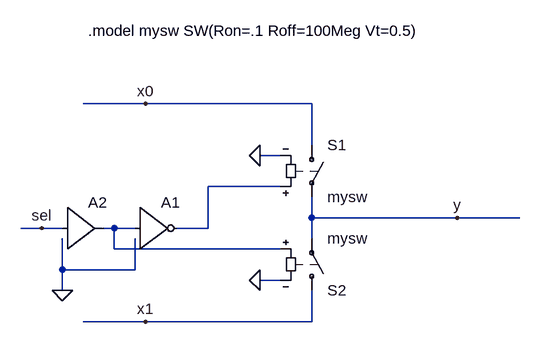
[diagram p0: schematic ideal_amux.asc]
ideal_amux.asc, the LTspice schematic file:
Version 4
SHEET 1 2652 680
WIRE 640 -48 544 -48
WIRE 896 -48 640 -48
WIRE 896 16 896 -48
WIRE 848 32 816 32
WIRE 848 80 736 80
WIRE 896 128 896 96
WIRE 1120 128 896 128
WIRE 1216 128 1120 128
WIRE 480 144 448 144
WIRE 512 144 480 144
WIRE 592 144 576 144
WIRE 624 144 592 144
WIRE 736 144 736 80
WIRE 736 144 688 144
WIRE 896 160 896 128
WIRE 592 176 592 144
WIRE 848 176 592 176
WIRE 512 208 512 160
WIRE 624 208 624 160
WIRE 624 208 512 208
WIRE 848 224 816 224
WIRE 512 240 512 208
WIRE 640 288 544 288
WIRE 896 288 896 240
WIRE 896 288 640 288
FLAG 640 -48 x0
FLAG 640 288 x1
FLAG 1120 128 y
FLAG 480 144 sel
FLAG 816 224 0
FLAG 816 32 0
FLAG 512 240 0
SYMBOL sw 896 0 R0
SYMATTR InstName S1
SYMATTR Value mysw
SYMBOL sw 896 256 M180
SYMATTR InstName S2
SYMATTR Value mysw
SYMBOL Digital\\inv 624 80 R0
SYMATTR InstName A1
SYMBOL Digital\\buf1 512 80 R0
SYMATTR InstName A2
TEXT 552 -160 Left 2 !.model mysw SW(Ron=.1 Roff=100Meg Vt=0.5)

The netlist it stands for:
* ideal_amux.asc
S1 x0 y N001 0 mysw
S2 x1 y N002 0 mysw
A1 N002 0 0 0 0 N001 0 0 BUF
A2 sel 0 0 0 0 0 N002 0 BUF
.model mysw SW(Ron=.1 Roff=100Meg Vt=0.5)
.backanno
.end